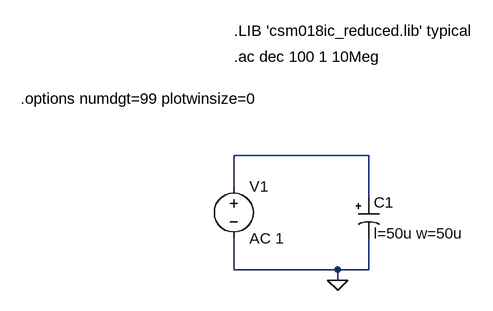
[diagram p0: schematic mim_cap.asc]
mim_cap.asc, the LTspice schematic file:
Version 4
SHEET 1 880 680
WIRE 208 288 0 288
WIRE 0 336 0 288
WIRE 208 352 208 288
WIRE 0 464 0 416
WIRE 160 464 0 464
WIRE 208 464 208 416
WIRE 208 464 160 464
WIRE 160 480 160 464
FLAG 160 480 0
SYMBOL voltage 0 320 R0
WINDOW 123 0 0 Left 0
WINDOW 39 0 0 Left 0
SYMATTR InstName V1
SYMATTR Value AC 1
SYMBOL polcap 192 352 R0
SYMATTR InstName C1
SYMATTR Value l=50u w=50u
SYMATTR Prefix X
SYMATTR SpiceModel mim
TEXT 0 96 Left 2 !.LIB 'csm018ic_reduced.lib' typical
TEXT 0 136 Left 2 !.ac dec 100 1 10Meg
TEXT -328 200 Left 2 !.options numdgt=99 plotwinsize=0

The netlist it stands for:
* mim_cap.asc
V1 N001 0 AC 1
XC1 N001 0 mim l=50u w=50u  ; pins A B
.LIB 'csm018ic_reduced.lib' typical
.ac dec 100 1 10Meg
.options numdgt=99 plotwinsize=0
.backanno
.end